# EAGLE schematic v_reg based CC circuit (EAGLE 9.2.2)
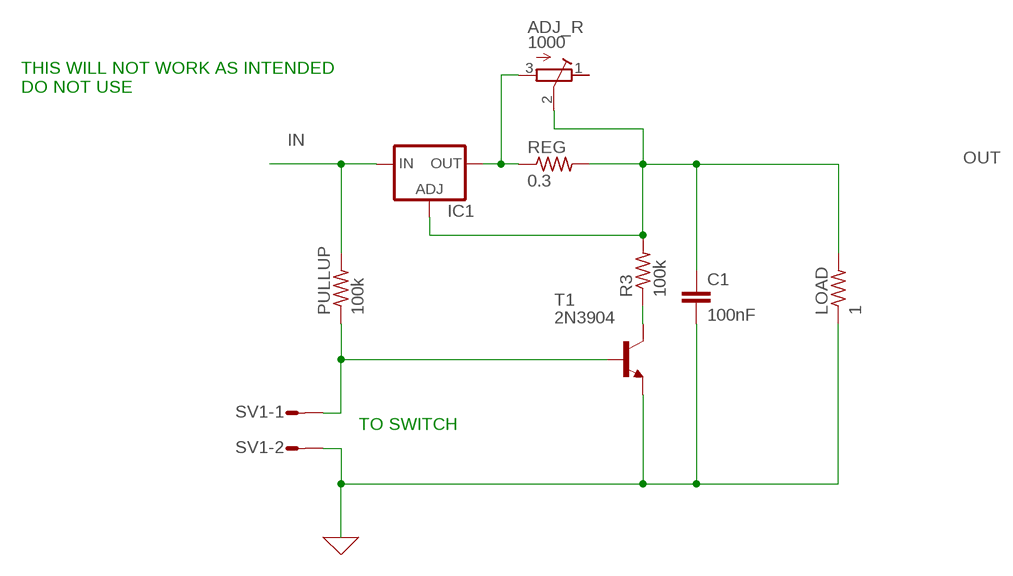
[diagram p0: schematic, sheet 1]

## Parts
ADJ_R  1000  R-TRIMMT93XA  [RTRIMT93XA]
C1  100nF  C2.5/2  [C2.5-2]
IC1  LM317TS  [317TS]
LOAD  1  R-US_0617/5V  [0617V]
PULLUP  100k  R-US_0207/7  [0207/7]
R3  100k  R-US_0207/7  [0207/7]
REG  0.3  R-US_0817/7V  [P0817V]
SV1  L02P  [L02P]
T1  2N3904  [TO92]

## Nets
0: C1.2 LOAD.1 SV1.2 T1.3(E) ; supply symbol labelled GND
IN: IC1.3(IN) PULLUP.2
N$2: PULLUP.1 SV1.1 T1.2(B)
N$3: R3.1 T1.1(C)
N$5: ADJ_R.3(A) IC1.2(OUT) REG.1
OUT: ADJ_R.2(S) C1.1 IC1.1(ADJ) LOAD.2 R3.2 REG.2
Unconnected: ADJ_R.1(E)

## Notes on the sheet
- THIS WILL NOT WORK AS INTENDED
  DO NOT USE
- TO SWITCH

## Library data of the parts
ADJ_R = resistor:R-TRIMM: Trimm resistor
C1 = capacitor-wima:C: CAPACITOR naming: grid - package width
IC1 = v-reg:LM317TS: VOLTAGE REGULATOR
LOAD PULLUP R3 REG = rcl:R-US_: RESISTOR, American symbol; SPICEPREFIX: R
SV1 = con-amp-mt:L02P: AMP MT CONNECTOR; OC_FARNELL: unknown; OC_NEWARK: unknown
T1 = transistor:2N3904: NPN TRANSISTOR